# Altium schematic sheet PAYL0004_PC_Microcontroller_IOIfaces.SchDoc: Payload Computer - Microcontroller I/O Interfaces
size A3; Engineer: Matt Brindley; Organization: BLUEsat Project; Address1: Room 419; Address2: School of EE&T; Address3: UNSW, NSW 2052; Address4: Australia; DocumentNumber: PAYL0004; Revision: 0.1; SheetNumber: 1; SheetTotal: 1; Description: I/0 Interfaces for the payload computer interface; Version: 1.0
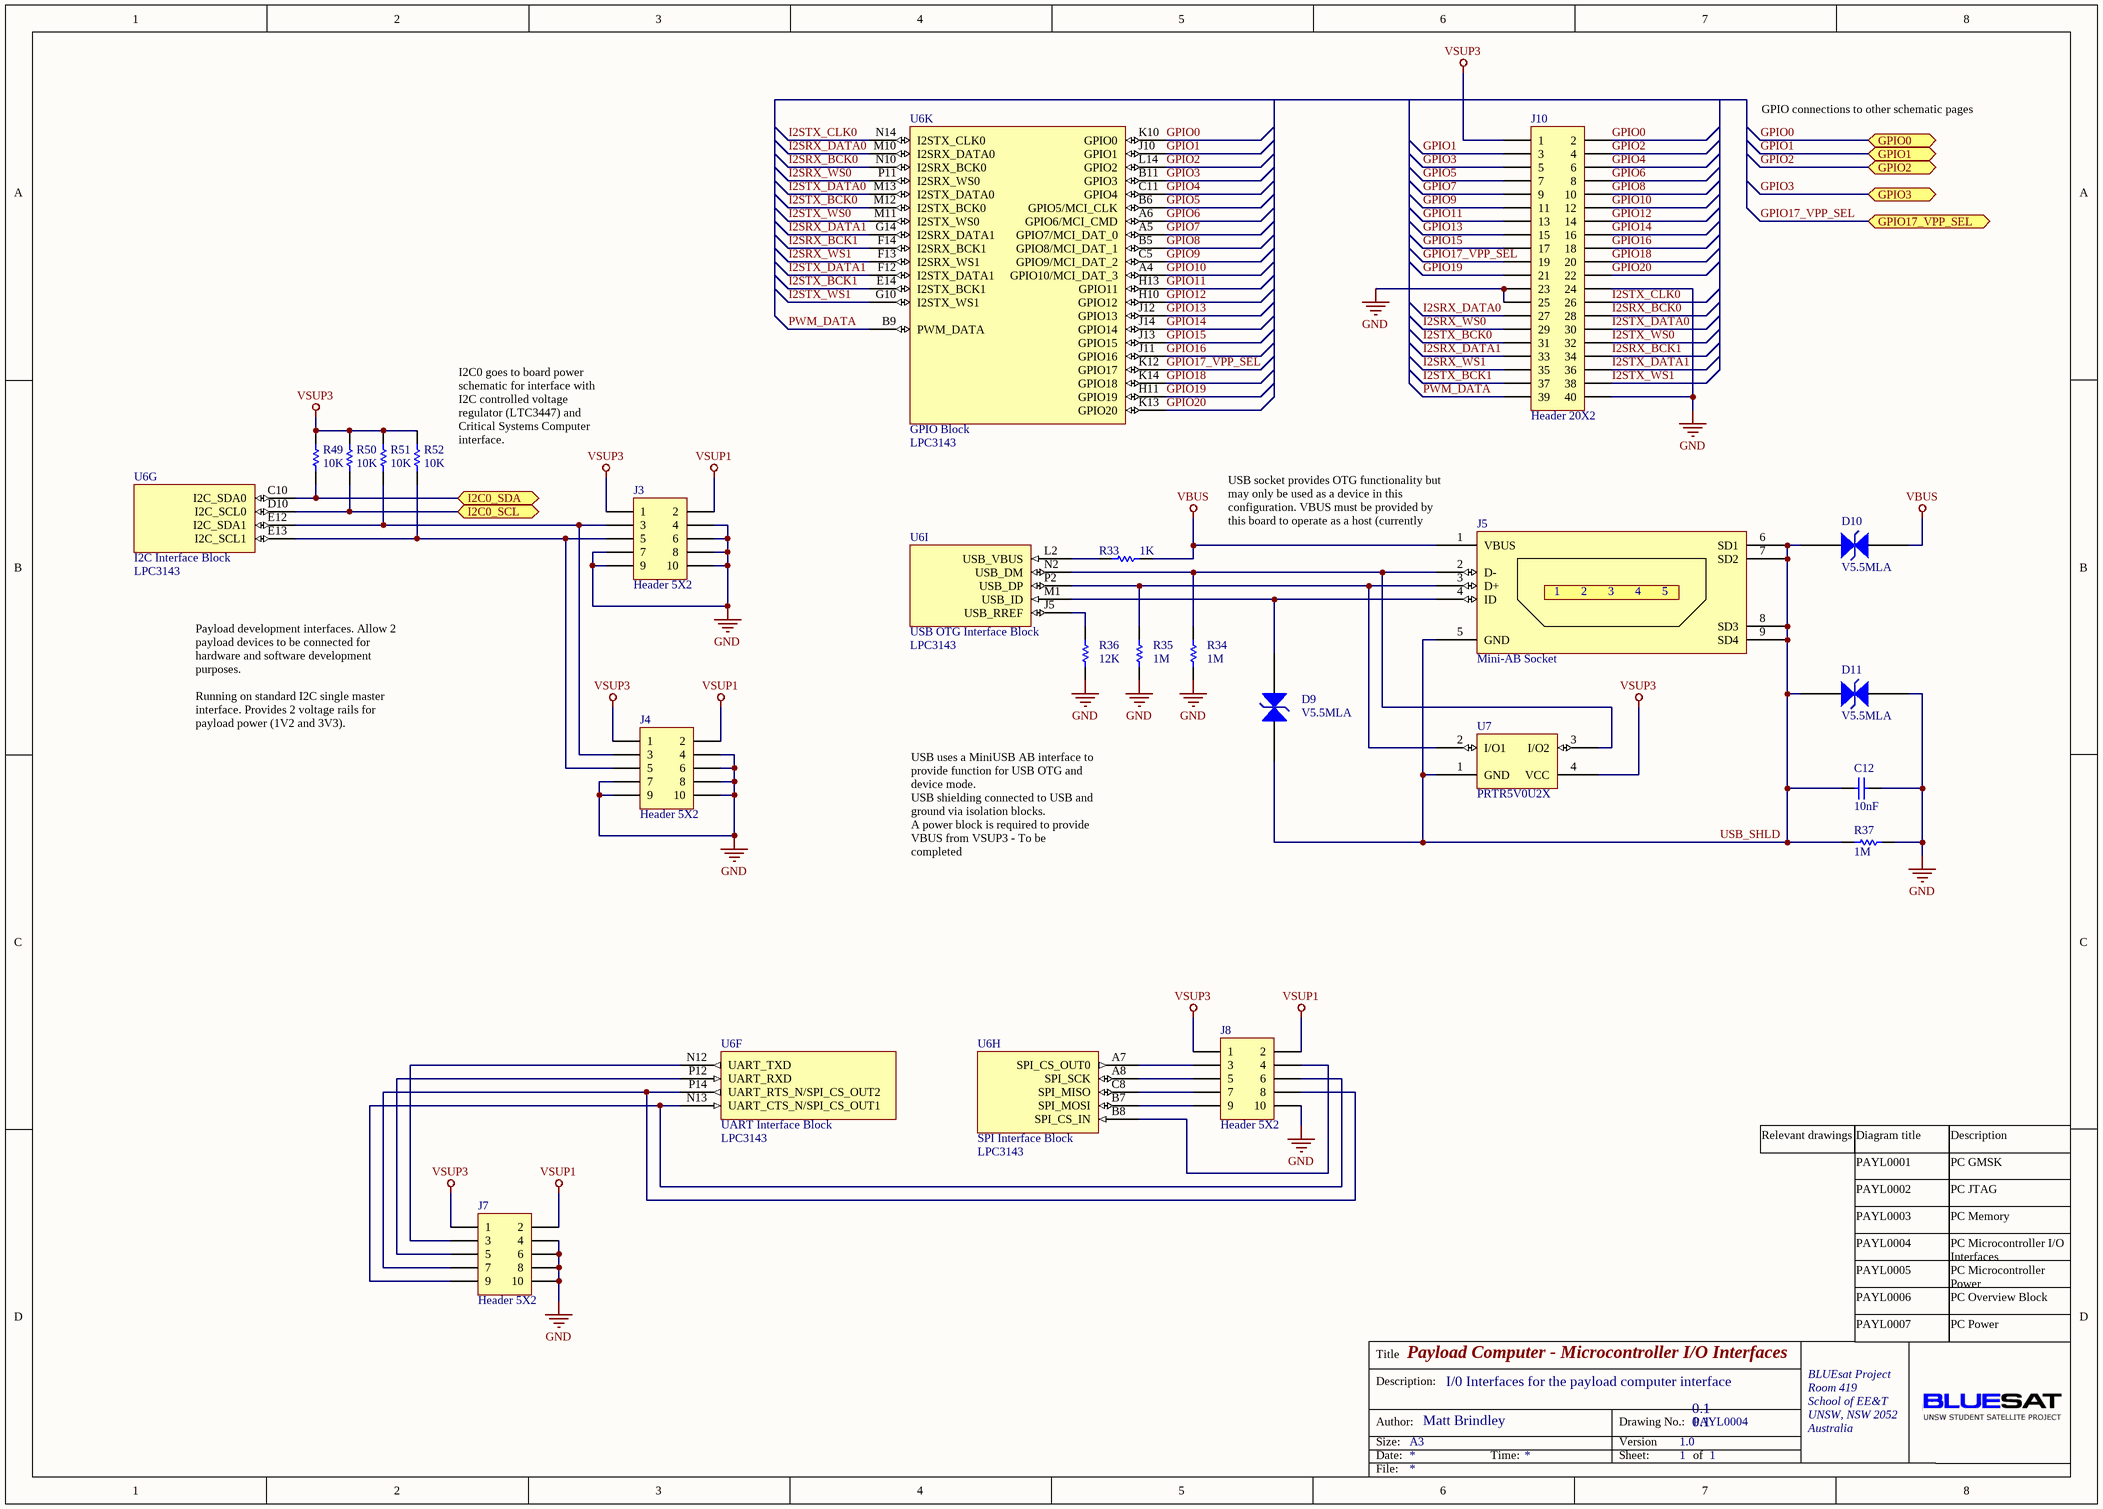
[diagram p0: PAYL0004_PC_Microcontroller_IOIfaces.SchDoc]

## Parts
C12  value 10nF  [C0805]  (hidden comment: Cap Semi)
D9  V5.5MLA  [MLA-1206]
D10  V5.5MLA  [MLA-1206]
D11  V5.5MLA  [MLA-1206]
J3  Header 5X2  [HDR2X5]
J4  Header 5X2  [HDR2X5]
J5  Mini-AB Socket  [miniUSB-AB]
J7  Header 5X2  [HDR2X5]
J8  Header 5X2  [HDR2X5]
J10  Header 20X2  [HDR2X20]
R33  value 1K  [6-0805_L]  (hidden comment: Res Semi)
R34  value 1M  [6-0805_L]  (hidden comment: Res Semi)
R35  value 1M  [6-0805_L]  (hidden comment: Res Semi)
R36  value 12K  [6-0805_L]  (hidden comment: Res Semi)
R37  value 1M  [6-0805_L]  (hidden comment: Res Semi)
R49  value 10K  [6-0805_L]  (hidden comment: Res Semi)
R50  value 10K  [6-0805_L]  (hidden comment: Res Semi)
R51  value 10K  [6-0805_L]  (hidden comment: Res Semi)
R52  value 10K  [6-0805_L]  (hidden comment: Res Semi)
U6  LPC3143  [BGA180C80P14X14_1200X1200X120]  (parts F,G,H,I,K of 11)
U7  PRTR5V0U2X  [SOT190P230X110-4N]

## Ports
GPIO0 (bidir), GPIO1 (bidir), GPIO2 (bidir), GPIO3 (bidir), GPIO17_VPP_SEL (bidir), I2C0_SCL (bidir), I2C0_SDA (bidir)

## Nets
GND: C12.1 D11.1 J3.4 J3.6 J3.7 J3.8 J3.9 J3.10 J4.4 J4.6 J4.7 J4.8 J4.9 J4.10 J7.4 J7.6 J7.8 J7.10 J8.10 J10.23 J10.24 J10.25 J10.40 R34.1 R35.1 R36.1 R37.1
VBUS: D10.1 J5.1(VBUS) R33.2
VSUP1: J3.2 J4.2 J7.2 J8.2
VSUP3: J3.1 J4.1 J7.1 J8.1 J10.1 R49.2 R50.2 R51.2 R52.2 U7.4(VCC)
GPIO0: J10.2 U6.K10(GPIO0) ; port GPIO0
GPIO1: J10.3 U6.J10(GPIO1) ; port GPIO1
GPIO2: J10.4 U6.L14(GPIO2) ; port GPIO2
GPIO3: J10.5 U6.B11(GPIO3) ; port GPIO3
GPIO4: J10.6 U6.C11(GPIO4)
GPIO5: J10.7 U6.B6(GPIO5/MCI_CLK)
GPIO6: J10.8 U6.A6(GPIO6/MCI_CMD)
GPIO7: J10.9 U6.A5(GPIO7/MCI_DAT_0)
GPIO8: J10.10 U6.B5(GPIO8/MCI_DAT_1)
GPIO9: J10.11 U6.C5(GPIO9/MCI_DAT_2)
GPIO10: J10.12 U6.A4(GPIO10/MCI_DAT_3)
GPIO11: J10.13 U6.H13(GPIO11)
GPIO12: J10.14 U6.H10(GPIO12)
GPIO13: J10.15 U6.J12(GPIO13)
GPIO14: J10.16 U6.J14(GPIO14)
GPIO15: J10.17 U6.J13(GPIO15)
GPIO16: J10.18 U6.J11(GPIO16)
GPIO17_VPP_SEL: J10.19 U6.K12(GPIO17) ; port GPIO17_VPP_SEL
GPIO18: J10.20 U6.K14(GPIO18)
GPIO19: J10.21 U6.H11(GPIO19)
GPIO20: J10.22 U6.K13(GPIO20)
I2C0_SCL: R50.1 U6.D10(I2C_SCL0) ; port I2C0_SCL
I2C0_SDA: R49.1 U6.C10(I2C_SDA0) ; port I2C0_SDA
I2SRX_BCK0: J10.28 U6.N10(I2SRX_BCK0)
I2SRX_BCK1: J10.34 U6.F14(I2SRX_BCK1)
I2SRX_DATA0: J10.27 U6.M10(I2SRX_DATA0)
I2SRX_DATA1: J10.33 U6.G14(I2SRX_DATA1)
I2SRX_WS0: J10.29 U6.P11(I2SRX_WS0)
I2SRX_WS1: J10.35 U6.F13(I2SRX_WS1)
I2STX_BCK0: J10.31 U6.M12(I2STX_BCK0)
I2STX_BCK1: J10.37 U6.E14(I2STX_BCK1)
I2STX_CLK0: J10.26 U6.N14(I2STX_CLK0)
I2STX_DATA0: J10.30 U6.M13(I2STX_DATA0)
I2STX_DATA1: J10.36 U6.F12(I2STX_DATA1)
I2STX_WS0: J10.32 U6.M11(I2STX_WS0)
I2STX_WS1: J10.38 U6.G10(I2STX_WS1)
PWM_DATA: J10.39 U6.B9(PWM_DATA)
USB_SHLD: C12.2 D9.1 D10.2 D11.2 J5.5(GND) J5.6(SD1) J5.7(SD2) J5.8(SD3) J5.9(SD4) R37.2 U7.1(GND)
NetD9_2: D9.2 J5.4(ID) U6.M1(USB_ID)
NetJ3_3: J3.3 J4.3 R51.1 U6.E12(I2C_SDA1)
NetJ3_5: J3.5 J4.5 R52.1 U6.E13(I2C_SCL1)
NetJ5_2: J5.2(D-) R34.2 U6.N2(USB_DM) U7.3(I/O2)
NetJ5_3: J5.3(D+) R35.2 U6.P2(USB_DP) U7.2(I/O1)
NetJ7_3: J7.3 U6.N12(UART_TXD)
NetJ7_5: J7.5 U6.P12(UART_RXD)
NetJ7_7: J7.7 J8.8 U6.P14(UART_RTS_N/SPI_CS_OUT2)
NetJ7_9: J7.9 J8.6 U6.N13(UART_CTS_N/SPI_CS_OUT1)
NetJ8_3: J8.3 U6.A7(SPI_CS_OUT0)
NetJ8_4: J8.4 U6.B8(SPI_CS_IN)
NetJ8_5: J8.5 U6.A8(SPI_SCK)
NetJ8_7: J8.7 U6.C8(SPI_MISO)
NetJ8_9: J8.9 U6.B7(SPI_MOSI)
NetR33_1: R33.1 U6.L2(USB_VBUS)
NetR36_2: R36.2 U6.J5(USB_RREF)

## Notes on the sheet
- GPIO connections to other schematic pages
- I2C0 goes to board power schematic for interface with I2C controlled voltage regulator (LTC3447) and Critical Systems Computer interface.
- (near J5) USB socket provides OTG functionality but may only be used as a device in this configuration. VBUS must be provided by this board to operate as a host (currently unimplemented).
- Payload development interfaces. Allow 2 payload devices to be connected for hardware and software development purposes.
  Running on standard I2C single master interface. Provides 2 voltage rails for payload power (1V2 and 3V3).
- USB uses a MiniUSB AB interface to provide function for USB OTG and device mode.
  USB shielding connected to USB and ground via isolation blocks.
  A power block is required to provide VBUS from VSUP3 - To be completed
- Relevant drawings
- PAYL0001
- Diagram title
- PC GMSK
- Description
- PAYL0002
- PAYL0003
- PAYL0004
- PC JTAG
- PC Memory
- PC Microcontroller I/O Interfaces
- PAYL0005
- PAYL0006
- PC Microcontroller Power
- PC Overview Block
- PAYL0007
- PC Power
- Title
- Description:
- Size:
- Author:
- Date:
- A3
- Time:
- Version
- Sheet:
- Drawing No.:
- of
- File:
- (in symbol LPC3143, part F) UART Interface Block
- (in symbol LPC3143, part G) I2C Interface Block
- (in symbol LPC3143, part H) SPI Interface Block
- (in symbol LPC3143, part I) USB OTG Interface Block
- (in symbol LPC3143, part K) GPIO Block

## Library data of the parts
C12 = Cap Semi: Capacitor (Semiconductor SIM Model); Published: 8-Jun-2000; LatestRevisionDate: 29-May-2009; LatestRevisionNote: IPC-7351 Footprint Added.; PackageReference: C1206; Publisher: Altium Limited; PackageDescription: Chip Capacitor
D9-D11 = V5.5MLA0603: Multilayer varistor - Transient voltage protection device; Published: 8-Jun-2000; LatestRevisionDate: 08-Jul-2005; LatestRevisionNote: Mech Layer 1 removed.; PackageReference: LED-0; Publisher: Altium Limited
J3 J4 J7 J8 = Header 5X2: Header, 5-Pin, Dual row; LatestRevisionDate: 17-Jul-2002; LatestRevisionNote: Re-released for DXP Platform.; Publisher: Altium Limited
J5 = miniUSB-AB: MiniUSB AB type socket; Published: 8-Jun-2000; LatestRevisionDate: 08-Jul-2005; LatestRevisionNote: Mech Layer 1 removed.; PackageReference: LED-0; Publisher: Altium Limited
J10 = Header 20X2: Header, 20-Pin, Dual row; LatestRevisionDate: 17-Jul-2002; LatestRevisionNote: Re-released for DXP Platform.; Publisher: Altium Limited
R33-R37 R49-R52 = Res Semi: Semiconductor Resistor; Published: 8-Jun-2000; LatestRevisionDate: 17-Jul-2002; LatestRevisionNote: Re-released for DXP Platform.; PackageReference: AXIAL-0.5; Publisher: Altium Limited
U6 = LPC3143: NXP ARM9 based microcontroller; Published: N/A; LatestRevisionDate: 09/03/2010; LatestRevisionNote: Created; PackageReference: BGA; Publisher: BLUEsat Project
U7 = PRTR5V0U2X: Electrostatic discharge protection diode IC - NXP; Published: 8-Jun-2000; LatestRevisionDate: 08-Jul-2005; LatestRevisionNote: Mech Layer 1 removed.; PackageReference: LED-0; Publisher: Altium Limited